# Altium schematic sheet LEDcontroller.SchDoc
size A; Author: MAKinteract; Revision: 1; SheetNumber: 2; SheetTotal: 3
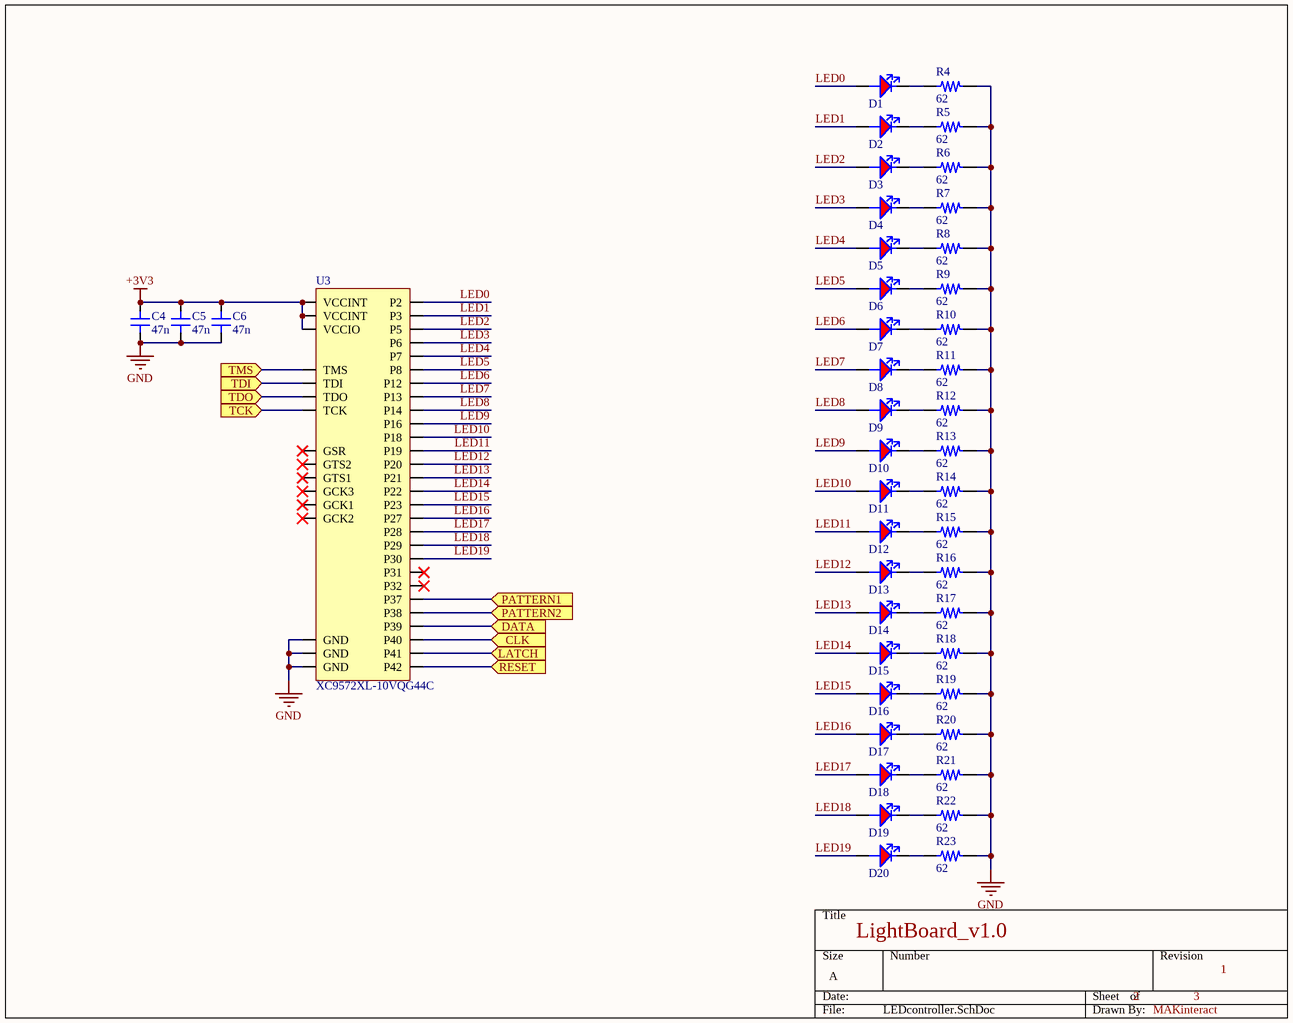
[diagram p0: LEDcontroller.SchDoc]

## Parts
C4  47n
C5  47n
C6  47n
D1  LED0402_RED  (value not drawn)
D2  LED0402_RED  (value not drawn)
D3  LED0402_RED  (value not drawn)
D4  LED0402_RED  (value not drawn)
D5  LED0402_RED  (value not drawn)
D6  LED0402_RED  (value not drawn)
D7  LED0402_RED  (value not drawn)
D8  LED0402_RED  (value not drawn)
D9  LED0402_RED  (value not drawn)
D10  LED0402_RED  (value not drawn)
D11  LED0402_RED  (value not drawn)
D12  LED0402_RED  (value not drawn)
D13  LED0402_RED  (value not drawn)
D14  LED0402_RED  (value not drawn)
D15  LED0402_RED  (value not drawn)
D16  LED0402_RED  (value not drawn)
D17  LED0402_RED  (value not drawn)
D18  LED0402_RED  (value not drawn)
D19  LED0402_RED  (value not drawn)
D20  LED0402_RED  (value not drawn)
R4  62
R5  62
R6  62
R7  62
R8  62
R9  62
R10  62
R11  62
R12  62
R13  62
R14  62
R15  62
R16  62
R17  62
R18  62
R19  62
R20  62
R21  62
R22  62
R23  62
U3  XC9572XL-10VQG44C

## Ports
CLK (in), DATA (in), LATCH (in), PATTERN1 (in), PATTERN2 (in), RESET (in), TCK (in), TDI (in), TDO (in), TMS (in)

## Nets
+3V3: C4.2 C5.2 C6.2 U3.15(VCCINT) U3.26(VCCIO) U3.35(VCCINT)
GND: C4.1 C5.1 C6.1 R4.2 R5.2 R6.2 R7.2 R8.2 R9.2 R10.2 R11.2 R12.2 R13.2 R14.2 R15.2 R16.2 R17.2 R18.2 R19.2 R20.2 R21.2 R22.2 R23.2 U3.4(GND) U3.17(GND) U3.25(GND)
CLK: U3.40(P40) ; port CLK
DATA: U3.39(P39) ; port DATA
LATCH: U3.41(P41) ; port LATCH
LED0: D1.1(A) U3.2(P2)
LED1: D2.1(A) U3.3(P3)
LED2: D3.1(A) U3.5(P5)
LED3: D4.1(A) U3.6(P6)
LED4: D5.1(A) U3.7(P7)
LED5: D6.1(A) U3.8(P8)
LED6: D7.1(A) U3.12(P12)
LED7: D8.1(A) U3.13(P13)
LED8: D9.1(A) U3.14(P14)
LED9: D10.1(A) U3.16(P16)
LED10: D11.1(A) U3.18(P18)
LED11: D12.1(A) U3.19(P19)
LED12: D13.1(A) U3.20(P20)
LED13: D14.1(A) U3.21(P21)
LED14: D15.1(A) U3.22(P22)
LED15: D16.1(A) U3.23(P23)
LED16: D17.1(A) U3.27(P27)
LED17: D18.1(A) U3.28(P28)
LED18: D19.1(A) U3.29(P29)
LED19: D20.1(A) U3.30(P30)
PATTERN1: U3.37(P37) ; port PATTERN1
PATTERN2: U3.38(P38) ; port PATTERN2
RESET: U3.42(P42) ; port RESET
TCK: U3.11(TCK) ; port TCK
TDI: U3.9(TDI) ; port TDI
TDO: U3.24(TDO) ; port TDO
TMS: U3.10(TMS) ; port TMS
NetD1_2: D1.2(K) R4.1
NetD2_2: D2.2(K) R5.1
NetD3_2: D3.2(K) R6.1
NetD4_2: D4.2(K) R7.1
NetD5_2: D5.2(K) R8.1
NetD6_2: D6.2(K) R9.1
NetD7_2: D7.2(K) R10.1
NetD8_2: D8.2(K) R11.1
NetD9_2: D9.2(K) R12.1
NetD10_2: D10.2(K) R13.1
NetD11_2: D11.2(K) R14.1
NetD12_2: D12.2(K) R15.1
NetD13_2: D13.2(K) R16.1
NetD14_2: D14.2(K) R17.1
NetD15_2: D15.2(K) R18.1
NetD16_2: D16.2(K) R19.1
NetD17_2: D17.2(K) R20.1
NetD18_2: D18.2(K) R21.1
NetD19_2: D19.2(K) R22.1
NetD20_2: D20.2(K) R23.1

Not connected (* = marked no-connect by the designer): U3 1(GCK3)* 31(P31)* 32(P32)* 33(GSR)* 34(GTS2)* 36(GTS1)* 43(GCK1)* 44(GCK2)*

## Notes on the sheet
- LightBoard_v1.0

## Library data of the parts
C4-C6 = C0805_47n: Cap Ceramic 0.047uF 50V X7R 5% SMD 0805 125C Paper T/R; Manufacturer: Yageo; Manufacturer Part Number: CC0805JRX7R9BB473; Capacitance: 47nF; Supplier 1: Digi-Key; Stock 1: 8317; RoHS: Yes; Mount: Surface Mount; Case/Package: 0805; Weight: 0.000194oz; Case Code (Imperial): 0805; Case Code (Metric): 2012; Min Operating Temperature: -55°C; Max Operating Temperature: 125°C; Tolerance: 5%; Voltage Rating: 50V; Voltage Rating (DC): 50V; Packaging: Tape and Reel; Dielectric: X7R; Termination: SMD/SMT; Composition: Ceramic; Length: 2mm; Height: 0.85mm; Width: 1.25mm; Thickness: 0.037inch; Depth: 1.25mm; Radiation Hardening: No; Lead Free: Lead Free; Halogen Free: Halogen Free; ComponentLink4URL: https://datasheet.ciiva.com/11587/upy-gphc-x7r-6-3v-to-50v-8-11587207.pdf?src-supplier=Avnet; ComponentLink4Description: https://datasheet.ciiva.com/11587/upy-gphc-x7r-6-3v-to-50v-8-11587207.pdf?src-supplier=Avnet; Supplier Part Number 1: 311-3553-6-ND; Pricing 1: 1 = 0.21000, 10 = 0.14700, 100 = 0.06900, 500 = 0.04838, 1000 = 0.04005 (USD)
D1-D20 = LED0402_RED: Led red; Manufacturer: Everlight; Manufacturer Part Number: EAST1005BA0; Color: Blue; Lens Color: Colorless; Lens Transparency: Clear; Luminous Intensity: 50mcd; Test Current: 5mA; Viewing Angle: 120°; Dominant Wavelength: 471nm; Forward Voltage: 3.3V; Number of LEDs: 1; Forward Current: 30mA; Power Rating: 75mW; Wavelength: 631nm; Lens Style: Rectangular,Square; Description: Led Blue Clear 2SMD; RoHS: Yes; Mount: Surface Mount; Case/Package: 0402; Packaging: Tape and Reel; Length: 1mm; Height: 0.45mm; Width: 0.5mm; Supplier 1: Digi-Key; Stock 1: 50832; Number of Pins: 2; Case Code (Imperial): 0402; Case Code (Metric): 1005; Min Operating Temperature: -30°C; Max Operating Temperature: 85°C; Package Quantity: 1; Illumination Color: Red; Radiation Hardening: No; Lead Free: Lead Free; REACH SVHC: Unknown; ComponentLink3URL: https://datasheet.ciiva.com/13945/vlmo1500-13945367.pdf?src-supplier=Digi-Key; ComponentLink3Description: https://datasheet.ciiva.com/13945/vlmo1500-13945367.pdf?src-supplier=Digi-Key; Supplier Part Number 1: VLMS1500-GS08DKR-ND; Pricing 1: 1 = 0.48000, 10 = 0.34600, 100 = 0.15360, 500 = 0.10752, 1000 = 0.08832 (USD)
R4-R23 = R0402_62: RES SMD 62 OHM 1% 1/16W 0402; Manufacturer: Yageo; Manufacturer Part Number: RC0402FR-0762RL; Resistance: 62R; Temperature Coefficient: 100ppm/°C; Voltage Rating (DC): 50V; Power Rating: 63mW; Supplier 1: Digi-Key; Stock 1: 193361; RoHS: Yes; Case/Package: 0402; Case Code (Imperial): 0402; Case Code (Metric): 1005; Min Operating Temperature: -55°C; Max Operating Temperature: 155°C; Packaging: Tape and Reel; Tolerance: 1%; Composition: Thick Film; Voltage Rating: 50V; Termination: SMD/SMT; Military Standard: Not; Length: 1mm; Height: 0.35mm; Width: 0.5mm; Depth: 0.5mm; REACH SVHC: Unknown; Lead Free: Lead Free; ComponentLink1URL: https://datasheet.ciiva.com/17086/pyu-rc0402-51-rohs-l-6-r-17086553.pdf?src-supplier=Future+Electronics; ComponentLink1Description: https://datasheet.ciiva.com/17086/pyu-rc0402-51-rohs-l-6-r-17086553.pdf?src-supplier=Future+Electronics; Supplier Part Number 1: 311-62.0LRDKR-ND; Pricing 1: 1 = 0.10000, 10 = 0.01600, 100 = 0.00640, 1000 = 0.00289, 2500 = 0.00251, 5000 = 0.00207 (USD)
U3 = XC9572XL: XILINX - XC9572XL-10VQG44C. - CPLD, 72 MACROCELL, 3.3V, 44VQFP; Propagation Delay: 10ns; Speed Grade: 10; Min Supply Voltage: 3V; Max Supply Voltage: 3.6V; Frequency: 178MHz; Number of Gates: 1600; Number of Logic Blocks (LABs): 4; Number of Macrocells: 72; Number of I/Os: 34; Memory Type: FLASH; Max Frequency: 100MHz; Supplier 1: Digi-Key; Manufacturer: Xilinx; Manufacturer Part Number: XC9572XL-10VQG44C; Stock 1: 4319; RoHS: Yes; Mount: Surface Mount; Case/Package: TQFP; Number of Pins: 44; Min Operating Temperature: 0°C; Max Operating Temperature: 70°C; Packaging: Tray; Operating Supply Voltage: 3.3V; Package Quantity: 160; Number of Logic Elements/Cells: 4; Termination: SMD/SMT; Turn-On Delay Time: 10ns; Radiation Hardening: No; REACH SVHC: No SVHC; Lead Free: Lead Free; ComponentLink3URL: https://datasheet.ciiva.com/1407/ds057-1407687.pdf?src-supplier=Digi-Key; ComponentLink3Description: https://datasheet.ciiva.com/1407/ds057-1407687.pdf?src-supplier=Digi-Key; Supplier Part Number 1: 122-1448-ND; Pricing 1: 1 = 3.71000 (USD)